# Altium schematic sheet Microcontroller.SchDoc
size C; DrawnBy: TIMKEN; SheetNumber: 2; SheetTotal: 7
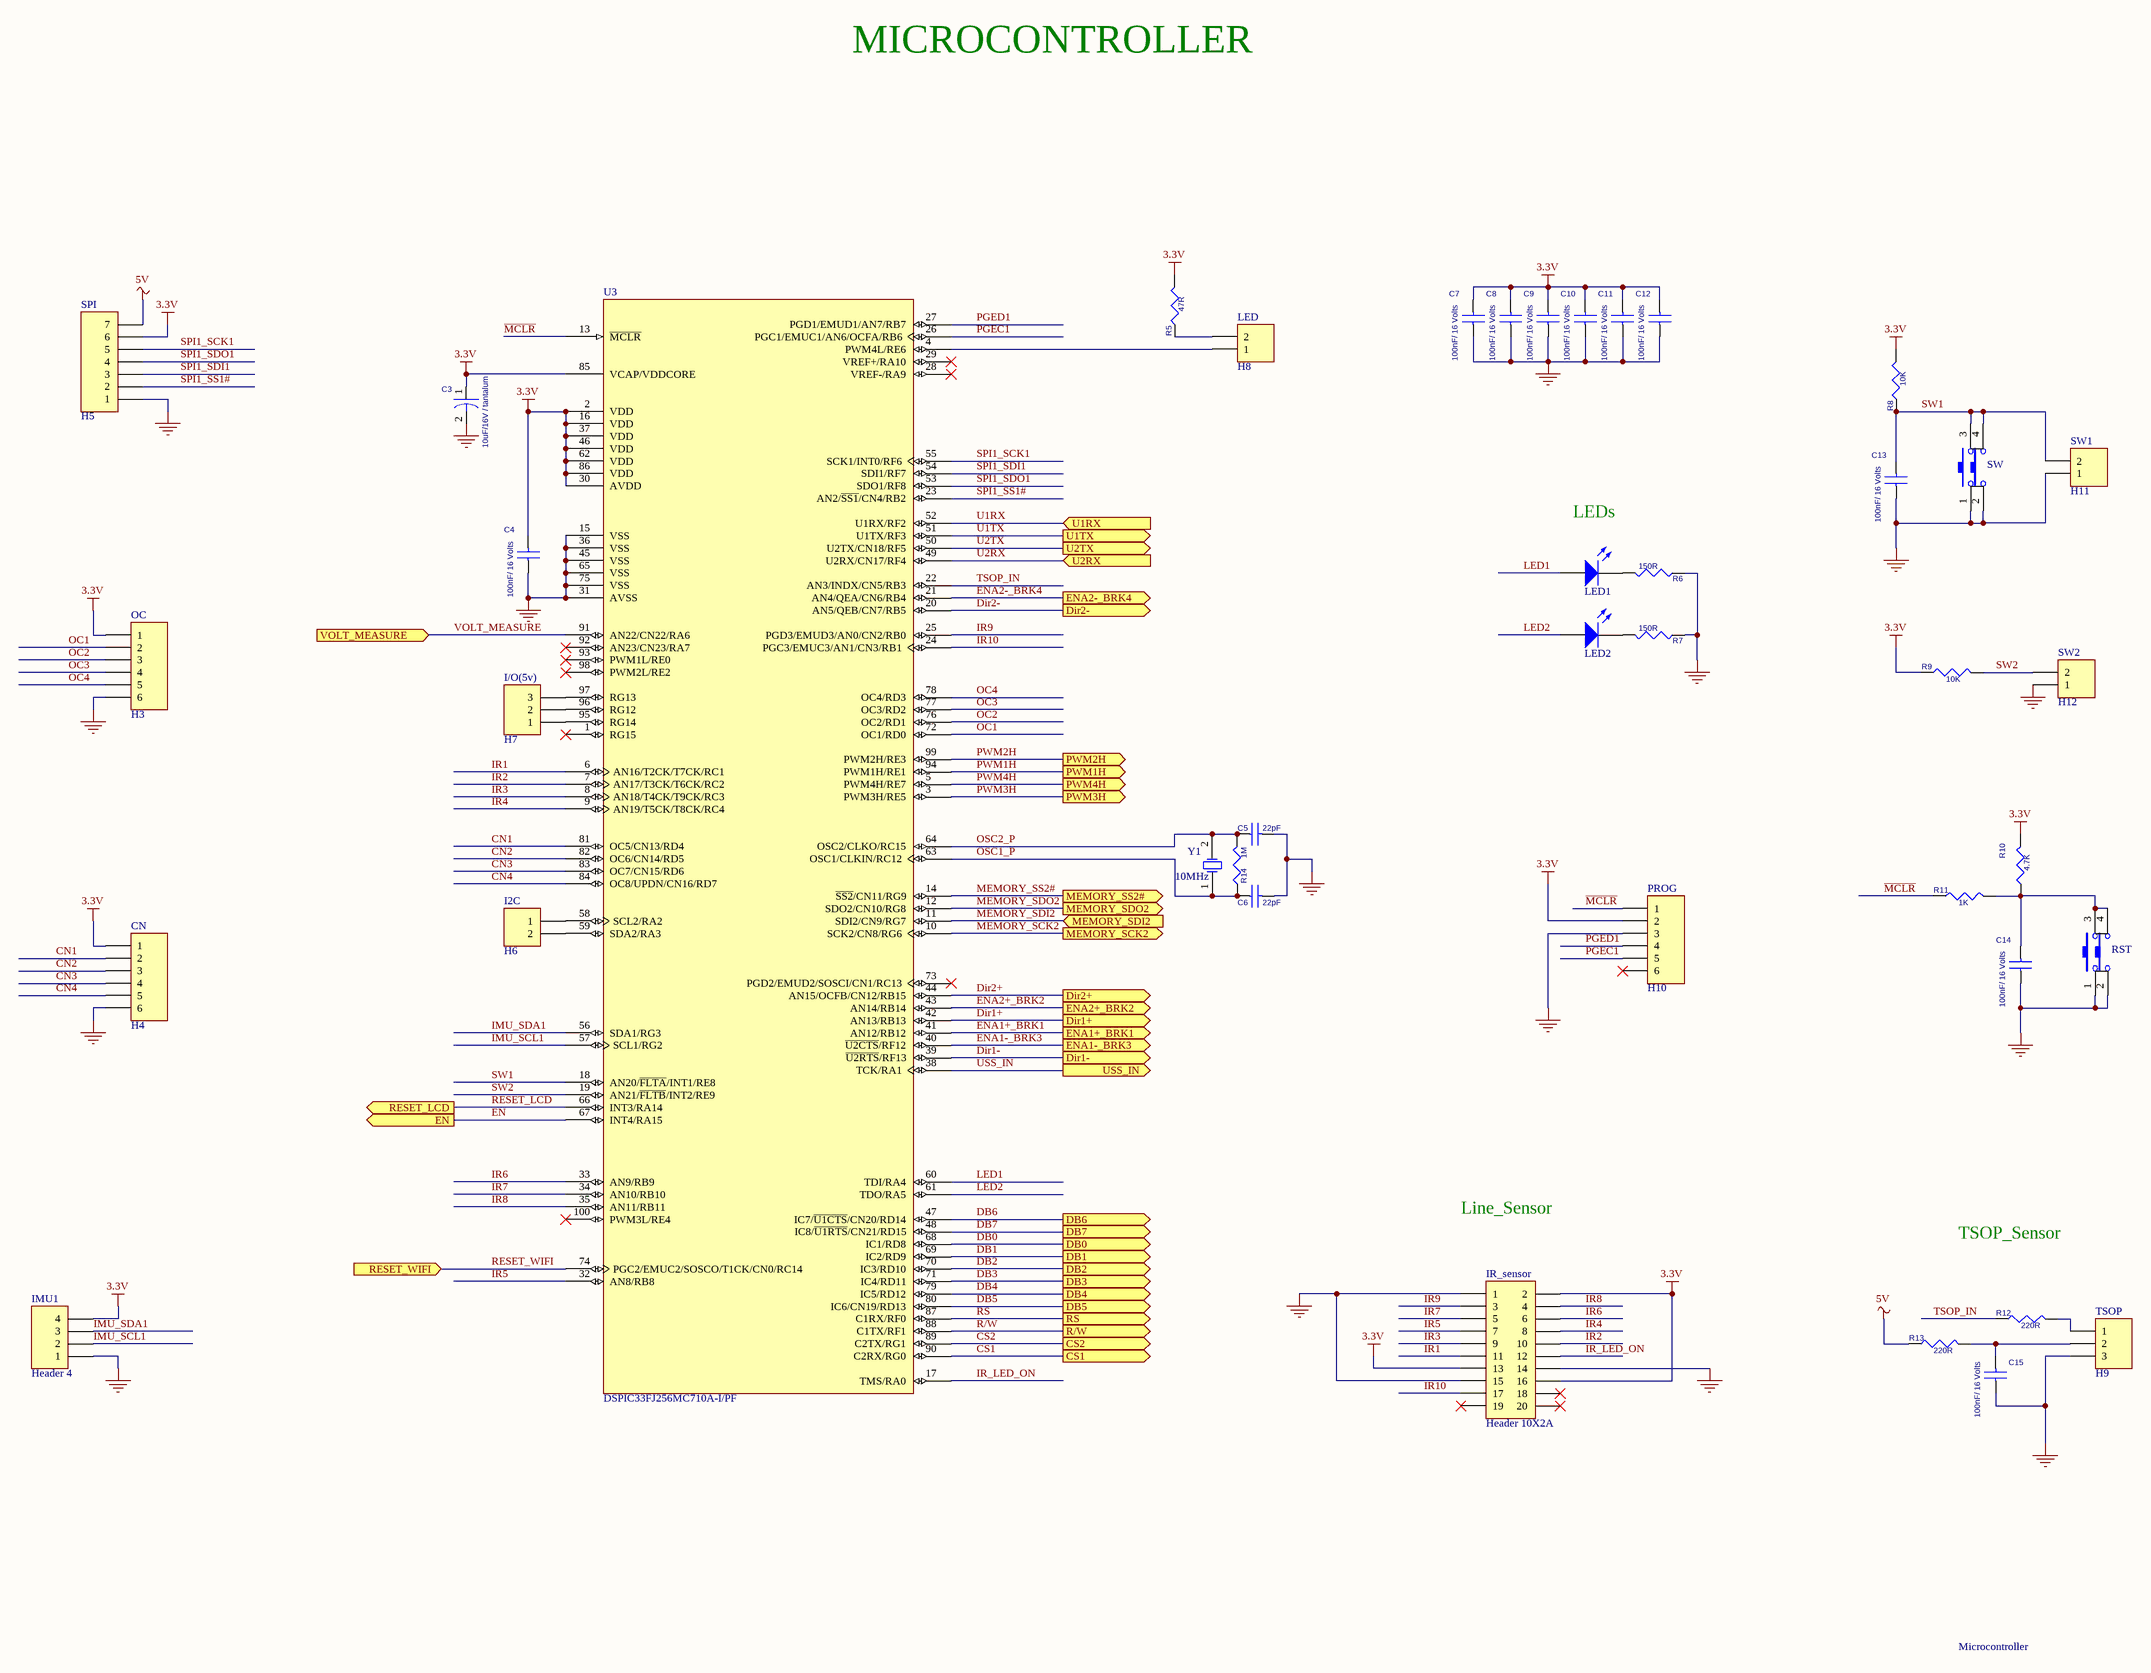
[diagram p0: Microcontroller.SchDoc]

## Parts
C3  10uF/16V / tantalum  [CAP_TANTALUM]
C4  100nF/ 16 Volts  [CAP_CERAMIC]
C5  22pF  [CAP_CERAMIC]
C6  22pF  [CAP_CERAMIC]
C7  100nF/ 16 Volts  [CAP_CERAMIC]
C8  100nF/ 16 Volts  [CAP_CERAMIC]
C9  100nF/ 16 Volts  [CAP_CERAMIC]
C10  100nF/ 16 Volts  [CAP_CERAMIC]
C11  100nF/ 16 Volts  [CAP_CERAMIC]
C12  100nF/ 16 Volts  [CAP_CERAMIC]
C13  100nF/ 16 Volts  [CAP_CERAMIC]
C14  100nF/ 16 Volts  [CAP_CERAMIC]
C15  100nF/ 16 Volts  [CAP_CERAMIC]
CN  H4  [1x6_single]
I2C  H6  [1x2_single]
I/O(5v)  H7  [1x3_single - duplicate]
IMU1  Header 4  [1x4_single]
IR_sensor  Header 10X2A  [10x2 row_ 2.54mm pitch]
LED  H8  [1x2_single]
LED1  LED1  [LED_SMD]  (value not drawn)
LED2  LED2  [LED_SMD]  (value not drawn)
OC  H3  [1x6_single]
PROG  H10  [1x6_single]
R5  47R  [RES_SMD]
R6  150R  [RES_SMD]
R7  150R  [RES_SMD]
R8  10K  [RES_SMD]
R9  10K  [RES_SMD]
R10  4.7K  [RES_SMD]
R11  1K  [RES_SMD]
R12  220R  [RES_SMD]
R13  220R  [RES_SMD]
R14  1M  [RES_SMD]
RST  SW-SMD  [SWITCH_SMD]  (value not drawn)
SPI  H5  [1x7_single]
SW  SW-SMD  [SWITCH_SMD]  (value not drawn)
SW1  H11  [1x2_single]
SW2  H12  [1x2_single]
TSOP  H9  [1x3_single - duplicate]
U3  DSPIC33FJ256MC710A-I/PF  [DSPIC33FJ256MC710-I/PF]
Y1  10MHz  [CRYSTAL_10MHZ]

## Ports
CS1 (out), CS2 (out), DB0 (out), DB1 (out), DB2 (out), DB3 (out), DB4 (out), DB5 (out), DB6 (out), DB7 (out), Dir1+ (out), Dir1- (out), Dir2+ (out), Dir2- (out), EN (out), ENA1+_BRK1 (out), ENA1-_BRK3 (out), ENA2+_BRK2 (out), ENA2-_BRK4 (out), MEMORY_SCK2 (out), MEMORY_SDI2 (in), MEMORY_SDO2 (out), MEMORY_SS2# (out), PWM1H (out), PWM2H (out), PWM3H (out), PWM4H (out), R/W (out), RESET_LCD (out), RESET_WIFI (in), RS (out), U1RX (in), U1TX (out), U2RX (in), U2TX (out), USS_IN (out), VOLT_MEASURE (in)

## Nets
3.3V: C3.1 C4.2 C7.2 C8.2 C9.2 C10.2 C11.2 C12.2 CN.1 IMU1.4 IR_sensor.2 IR_sensor.13 IR_sensor.16 OC.1 PROG.2 R5.2 R8.2 R9.1 R10.2 SPI.6 U3.2(VDD) U3.16(VDD) U3.30(AVDD) U3.37(VDD) U3.46(VDD) U3.62(VDD) U3.85(VCAP/VDDCORE) U3.86(VDD)
5V: R13.1 SPI.7
GND_POWER: C3.2 C4.1 C5.2 C6.2 C7.1 C8.1 C9.1 C10.1 C11.1 C12.1 C13.1 C14.1 C15.1 CN.6 IMU1.1 IR_sensor.1 IR_sensor.14 IR_sensor.15 OC.6 PROG.3 R6.1 R7.1 RST.1 RST.2 SPI.1 SW.1 SW.2 SW1.1 SW2.1 TSOP.3 U3.15(VSS) U3.31(AVSS) U3.36(VSS) U3.45(VSS) U3.65(VSS) U3.75(VSS)
CN1: CN.2 U3.81(OC5/CN13/RD4)
CN2: CN.3 U3.82(OC6/CN14/RD5)
CN3: CN.4 U3.83(OC7/CN15/RD6)
CN4: CN.5 U3.84(OC8/UPDN/CN16/RD7)
CS1: U3.90(C2RX/RG0) ; port CS1
CS2: U3.89(C2TX/RG1) ; port CS2
DB0: U3.68(IC1/RD8) ; port DB0
DB1: U3.69(IC2/RD9) ; port DB1
DB2: U3.70(IC3/RD10) ; port DB2
DB3: U3.71(IC4/RD11) ; port DB3
DB4: U3.79(IC5/RD12) ; port DB4
DB5: U3.80(IC6/CN19/RD13) ; port DB5
DB6: U3.47(IC7/~{U1CTS}/CN20/RD14) ; port DB6
DB7: U3.48(IC8/~{U1RTS}/CN21/RD15) ; port DB7
Dir1+: U3.42(AN13/RB13) ; port Dir1+
Dir1-: U3.39(~{U2RTS}/RF13) ; port Dir1-
Dir2+: U3.44(AN15/OCFB/CN12/RB15) ; port Dir2+
Dir2-: U3.20(AN5/QEB/CN7/RB5) ; port Dir2-
EN: U3.67(INT4/RA15) ; port EN
ENA1+_BRK1: U3.41(AN12/RB12) ; port ENA1+_BRK1
ENA1-_BRK3: U3.40(~{U2CTS}/RF12) ; port ENA1-_BRK3
ENA2+_BRK2: U3.43(AN14/RB14) ; port ENA2+_BRK2
ENA2-_BRK4: U3.21(AN4/QEA/CN6/RB4) ; port ENA2-_BRK4
IMU_SCL1: IMU1.2 U3.57(SCL1/RG2)
IMU_SDA1: IMU1.3 U3.56(SDA1/RG3)
IR1: IR_sensor.11 U3.6(AN16/T2CK/T7CK/RC1)
IR2: IR_sensor.10 U3.7(AN17/T3CK/T6CK/RC2)
IR3: IR_sensor.9 U3.8(AN18/T4CK/T9CK/RC3)
IR4: IR_sensor.8 U3.9(AN19/T5CK/T8CK/RC4)
IR5: IR_sensor.7 U3.32(AN8/RB8)
IR6: IR_sensor.6 U3.33(AN9/RB9)
IR7: IR_sensor.5 U3.34(AN10/RB10)
IR8: IR_sensor.4 U3.35(AN11/RB11)
IR9: IR_sensor.3 U3.25(PGD3/EMUD3/AN0/CN2/RB0)
IR10: IR_sensor.17 U3.24(PGC3/EMUC3/AN1/CN3/RB1)
IR_LED_ON: IR_sensor.12 U3.17(TMS/RA0)
LED1: LED1.1(A) U3.60(TDI/RA4)
LED2: LED2.1(A) U3.61(TDO/RA5)
~{MCLR}: PROG.1 R11.1 U3.13(~{MCLR})
MEMORY_SCK2: U3.10(SCK2/CN8/RG6) ; port MEMORY_SCK2
MEMORY_SDI2: U3.11(SDI2/CN9/RG7) ; port MEMORY_SDI2
MEMORY_SDO2: U3.12(SDO2/CN10/RG8) ; port MEMORY_SDO2
MEMORY_SS2#: U3.14(~{SS2}/CN11/RG9) ; port MEMORY_SS2#
OC1: OC.2 U3.72(OC1/RD0)
OC2: OC.3 U3.76(OC2/RD1)
OC3: OC.4 U3.77(OC3/RD2)
OC4: OC.5 U3.78(OC4/RD3)
OSC1_P: C6.1 R14.1 U3.63(OSC1/CLKIN/RC12) Y1.1(OSC1)
OSC2_P: C5.1 R14.2 U3.64(OSC2/CLKO/RC15) Y1.2(OSC2)
PGEC1: PROG.5 U3.26(PGC1/EMUC1/AN6/OCFA/RB6)
PGED1: PROG.4 U3.27(PGD1/EMUD1/AN7/RB7)
PWM1H: U3.94(PWM1H/RE1) ; port PWM1H
PWM2H: U3.99(PWM2H/RE3) ; port PWM2H
PWM3H: U3.3(PWM3H/RE5) ; port PWM3H
PWM4H: U3.5(PWM4H/RE7) ; port PWM4H
R/W: U3.88(C1TX/RF1) ; port R/W
RESET_LCD: U3.66(INT3/RA14) ; port RESET_LCD
RESET_WIFI: U3.74(PGC2/EMUC2/SOSCO/T1CK/CN0/RC14) ; port RESET_WIFI
RS: U3.87(C1RX/RF0) ; port RS
SPI1_SCK1: SPI.5 U3.55(SCK1/INT0/RF6)
SPI1_SDI1: SPI.3 U3.54(SDI1/RF7)
SPI1_SDO1: SPI.4 U3.53(SDO1/RF8)
SPI1_SS1#: SPI.2 U3.23(AN2/~{SS1}/CN4/RB2)
SW1: C13.2 R8.1 SW.3 SW.4 SW1.2 U3.18(AN20/~{FLTA}/INT1/RE8)
SW2: R9.2 SW2.2 U3.19(AN21/~{FLTB}/INT2/RE9)
TSOP_IN: R12.1 U3.22(AN3/INDX/CN5/RB3)
U1RX: U3.52(U1RX/RF2) ; port U1RX
U1TX: U3.51(U1TX/RF3) ; port U1TX
U2RX: U3.49(U2RX/CN17/RF4) ; port U2RX
U2TX: U3.50(U2TX/CN18/RF5) ; port U2TX
USS_IN: U3.38(TCK/RA1) ; port USS_IN
VOLT_MEASURE: U3.91(AN22/CN22/RA6) ; port VOLT_MEASURE
NetC14_2: C14.2 R10.1 R11.2 RST.3 RST.4
NetC15_2: C15.2 R13.2 TSOP.2
NetI2C_1: I2C.1 U3.58(SCL2/RA2)
NetI2C_2: I2C.2 U3.59(SDA2/RA3)
NetI/O(5v)_1: I/O(5v).1 U3.95(RG14)
NetI/O(5v)_2: I/O(5v).2 U3.96(RG12)
NetI/O(5v)_3: I/O(5v).3 U3.97(RG13)
NetLED1_2: LED1.2(K) R6.2
NetLED2_2: LED2.2(K) R7.2
NetLED_1: LED.1 U3.4(PWM4L/RE6)
NetLED_2: LED.2 R5.1
NetR12_2: R12.2 TSOP.1

Not connected (* = marked no-connect by the designer): IR_sensor 18* 19* 20*; PROG 6*; U3 1(RG15)* 28(VREF-/RA9)* 29(VREF+/RA10)* 73(PGD2/EMUD2/SOSCI/CN1/RC13)* 92(AN23/CN23/RA7)* 93(PWM1L/RE0)* 98(PWM2L/RE2)* 100(PWM3L/RE4)*

## Notes on the sheet
- MICROCONTROLLER
- LEDs
- Line_Sensor
- TSOP_Sensor
- Microcontroller

## Library data of the parts
C3 = C_0: M P No: TPSB106K016R0500; Vendor: Digikey; Descr: CAP TANT 10UF 16V 10% 1210,0.138" L x 0.110" W (3.50mm x 2.80mm); V P No: 478-5230-6-ND; Footprint: C1210
C4-C15 = CAP NP: V P No: 644160RL; Vendor: Farnell; M P No: CC0805KRX7R7BB104; Descr: CAPACITOR, 0805, 100NF, 16V, X7R; FootPrint: C0805
CN OC PROG = Header 6: Header, 6-Pin; LatestRevisionDate: 17-Jul-2002; LatestRevisionNote: Re-released for DXP Platform.; Publisher: Altium Limited
I2C LED SW1 SW2 = Header 2: Header, 2-Pin; LatestRevisionDate: 17-Jul-2002; LatestRevisionNote: Re-released for DXP Platform.; Publisher: Altium Limited
I/O(5v) TSOP = Header 3: Header, 3-Pin; LatestRevisionDate: 17-Jul-2002; LatestRevisionNote: Re-released for DXP Platform.; Publisher: Altium Limited
IMU1 = Header 4: Header, 4-Pin; LatestRevisionDate: 17-Jul-2002; LatestRevisionNote: Re-released for DXP Platform.; Publisher: Altium Limited
IR_sensor = Header 10x2: Header, 20Pin, Dual row; LatestRevisionDate: 17-Jul-2002; LatestRevisionNote: Re-released for DXP Platform.; Publisher: Altium Limited
LED1 LED2 = LED_SMD: Typical INFRARED GaAs LED_throughole; Published: 8-Jun-2000; LatestRevisionDate: 08-Jul-2005; LatestRevisionNote: Mech Layer 1 removed.; PackageReference: LED-0; Publisher: Altium Limited; PackageDescription: LED; 2 Leads
R5-R14 = RESISTOR: Vendor: Digikey; Descr: RES 10K OHM 1/2W 5% 0805 SMD; V P No: P10KADTR-ND; M P No: ERJ-P06J103V; FootPrint: 0.079" L x 0.049" W (2.00mm x 1.25mm)  (0805 (2012 Metric)  )
RST SW = SW-SMD: Switch; V P No: SW836CT-ND; M P No: B3S-1000P; Vendor: Digikey; Descr: SWITCH TACTILE SPST-NO 0.05A 24V; Published: 24-Mar-1999; LatestRevisionDate: 17-Jul-2002; LatestRevisionNote: Re-released for DXP Platform.; PackageReference: SPST-2; Publisher: Altium Limited; PackageDescription: Switch; 2 Leads; FootPrint: 6.60mm x 6.00mm  Outlile(Refer Datasheet)
SPI = Header 7_1: Header, 6-Pin; LatestRevisionDate: 17-Jul-2002; LatestRevisionNote: Re-released for DXP Platform.; Publisher: Altium Limited
U3 = DSPIC33FJ256MC710-I/PF: High-Performance 16-bit Digital Signal Controller, 256 KB Flash, 30 KB RAM, 100-Pin TQFP, Industrial Temperature; Published: 29-Jan-2009; LatestRevisionDate: 02-Dec-2009; LatestRevisionNote: Updated to datasheet revision C, Mar-2009; DatasheetVersion: revC, Mar-2009; PackageVersion: revBB, Aug-2009; PackageReference: TQFP-PF100; Publisher: Altium Limited; PackageDescription: 100-Lead Thin Plastic Quad Flat Pack (PF) - 14x14x1mm Body, 2.00mm [TQFP]; Supplier 1: Digi-Key; Supplier Part Number 1: DSPIC33FJ256MC710-I/PF-ND; Supplier 2: Farnell; Supplier Part Number 2: 1332045; ComponentLink1Description: Datasheet; ComponentLink1URL: http://ww1.microchip.com/downloads/en/DeviceDoc/70287C.pdf; ComponentLink2Description: Packaging Specification; ComponentLink2URL: http://www.microchip.com/stellent/groups/techpub_sg/documents/packagingspec/en012702.pdf; ComponentLink3Description: Microchip.com Home; ComponentLink3URL: http://www.microchip.com/
Y1 = XTAL: Crystal Oscillator; Descr: Crystals 10MHz 20pF 30ppm -40C 85C; M P No: ECS-100-20-4X-DU; Vendor: Mouser; Published: 8-Jun-2000; LatestRevisionDate: 17-Jul-2002; LatestRevisionNote: Re-released for DXP Platform.; PackageReference: R38; Publisher: Altium Limited; FootPrint: 3.8 mm W x 11.1 mm L x 4.3 mm H; V P No: Crystals 10MHz 20pF 30ppm -40C 85C